# EAGLE design Sensor de Presença (EAGLE 8.2.2)
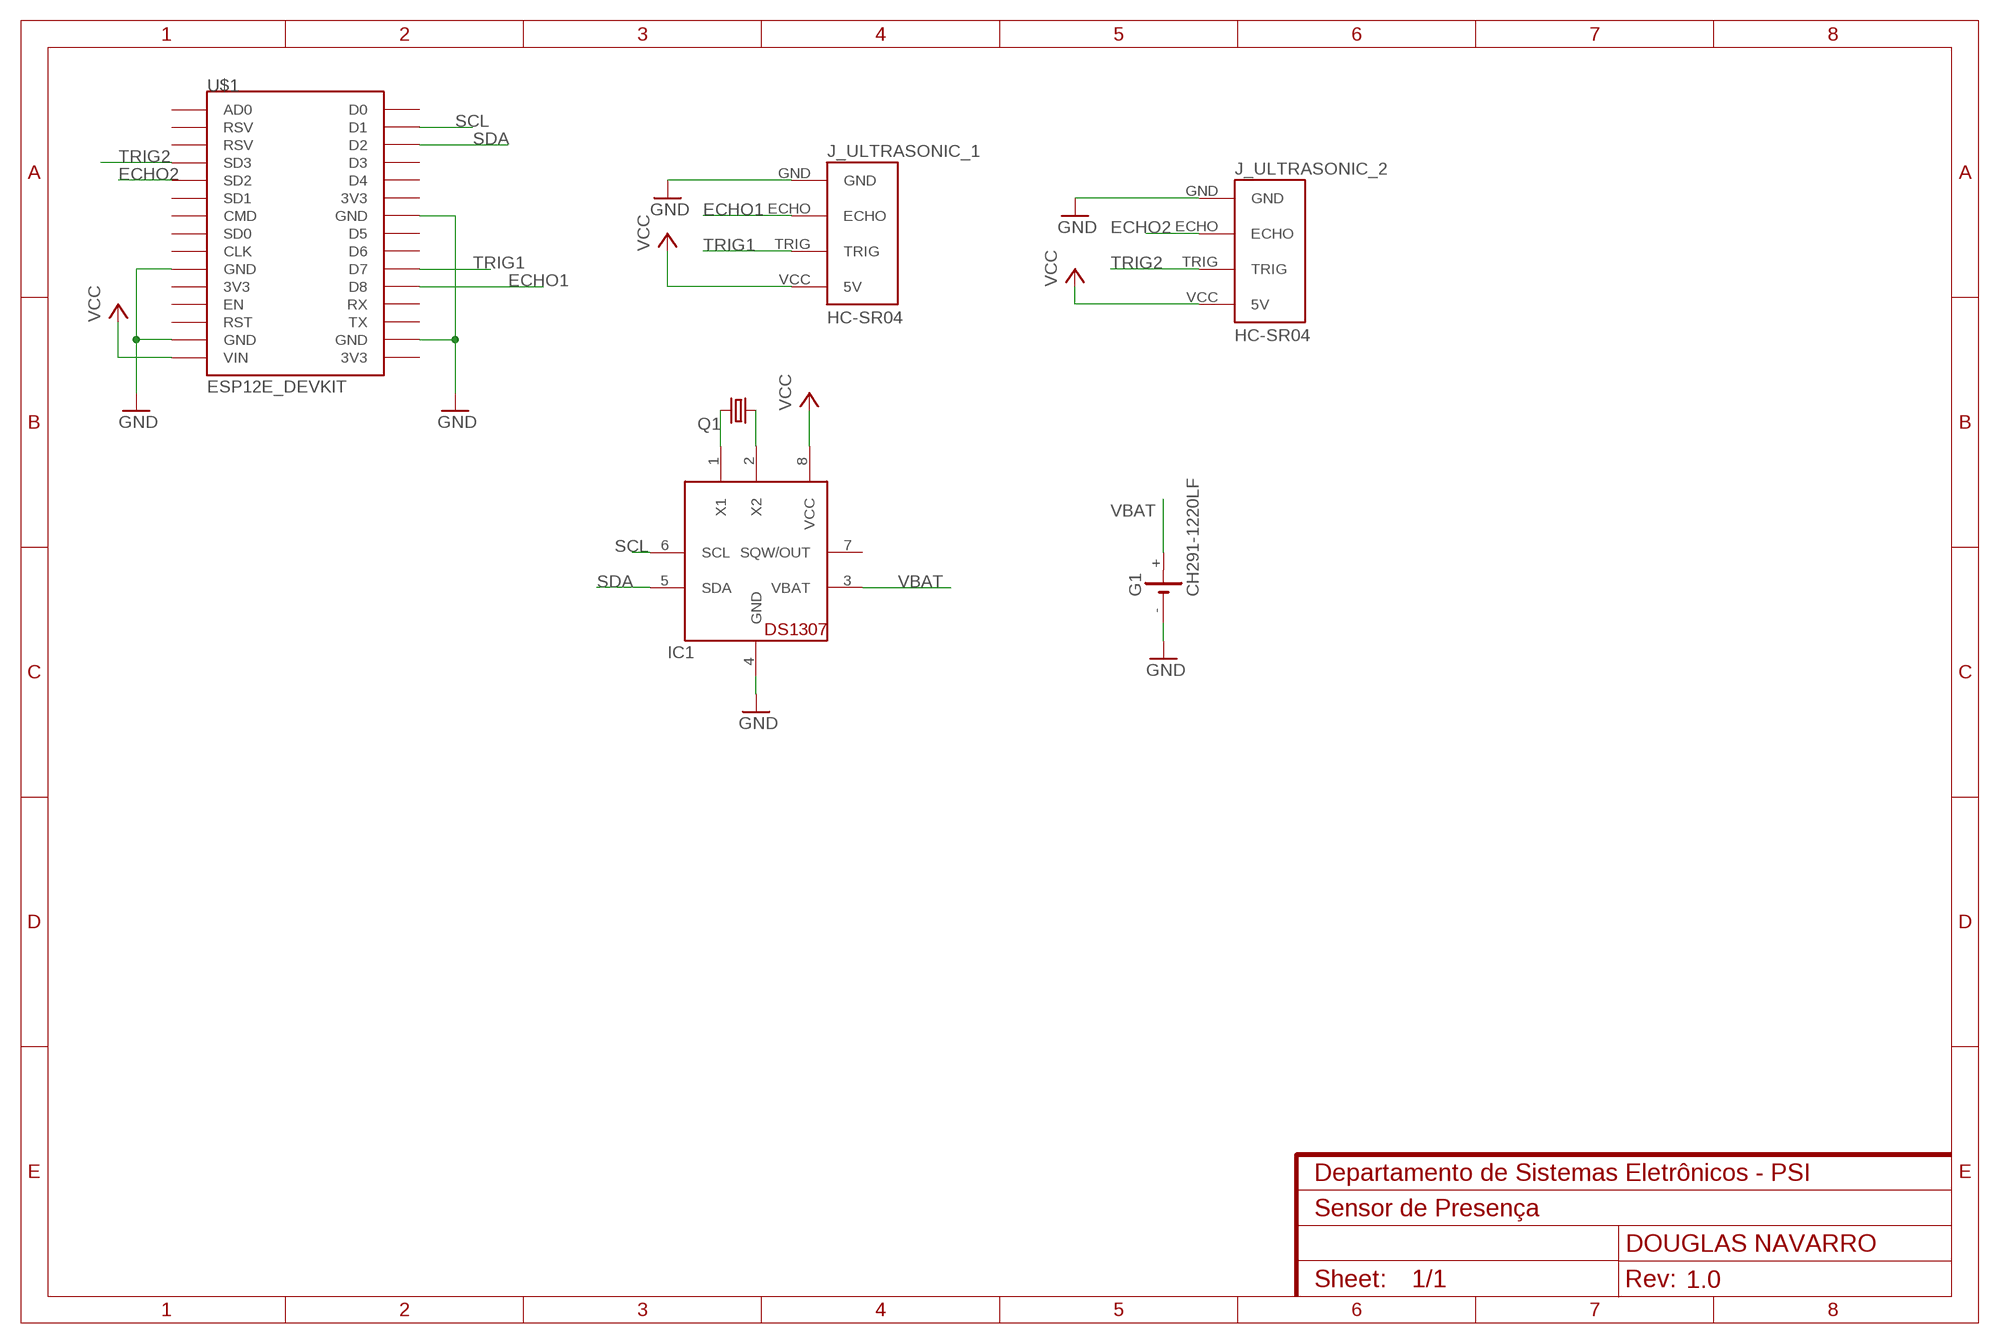
[diagram p0: schematic, sheet 1]

## Parts
G1  CH291-1220LF  [CH291-1220LF]
IC1  DS1307  [DIL08]
J_ULTRASONIC_1  HC-SR04  [HC-SR04_FOOTPRINT]
J_ULTRASONIC_2  HC-SR04  [HC-SR04_FOOTPRINT]
Q1  CRYSTALTC38H  [TC38H]
U$1  ESP12E_DEVKIT  [ESP12E_DEVKIT]

## Nets
ECHO1: J_ULTRASONIC_1.ECHO U$1.D8
ECHO2: J_ULTRASONIC_2.ECHO U$1.SD2
GND: G1.- IC1.4(GND) J_ULTRASONIC_1.GND J_ULTRASONIC_2.GND U$1.GND@0(GND) U$1.GND@1(GND) U$1.GND@2(GND) U$1.GND@3(GND)
N$1: IC1.1(X1) Q1.2
N$2: IC1.2(X2) Q1.1
SCL: IC1.6(SCL) U$1.D1
SDA: IC1.5(SDA) U$1.D2
TRIG1: J_ULTRASONIC_1.TRIG U$1.D7
TRIG2: J_ULTRASONIC_2.TRIG U$1.SD3
VBAT: G1.+ IC1.3(VBAT)
VCC: IC1.8(VCC) J_ULTRASONIC_1.VCC(5V) J_ULTRASONIC_2.VCC(5V) U$1.VIN
Unconnected: IC1.7(SQW/OUT) U$1.3V3@0(3V3) U$1.3V3@1(3V3) U$1.3V3@2(3V3) U$1.AD0 U$1.CLK U$1.CMD U$1.D0 U$1.D3 U$1.D4 U$1.D5 U$1.D6 U$1.EN U$1.RST U$1.RSV@0(RSV) U$1.RSV@1(RSV) U$1.RX U$1.SD0 U$1.SD1 U$1.TX

## Library data of the parts
G1 = battery:CH291-1220LF: Battery Holder, SMT, 12mm multicomp PART NO. CH291-1220LF Source: Data sheet <http://www.farnell.com/datasheets/1505860.pdf>
IC1 = adafruit:DS1307: DS1307 Real time clock (RTC) with battery backup ability. Talk to it via i2c
J_ULTRASONIC_1 J_ULTRASONIC_2 = Ultrasonic Sensor HC-SR04:HC-SR04: Ultrasonic Sensor HC-SR04
Q1 = adafruit:CRYSTAL: CRYSTAL; OC_FARNELL: unknown; OC_NEWARK: unknown
U$1 = ESP12E_DEVKIT:ESP12E_DEVKIT: ESP12E DEVKIT BOARD

## Board
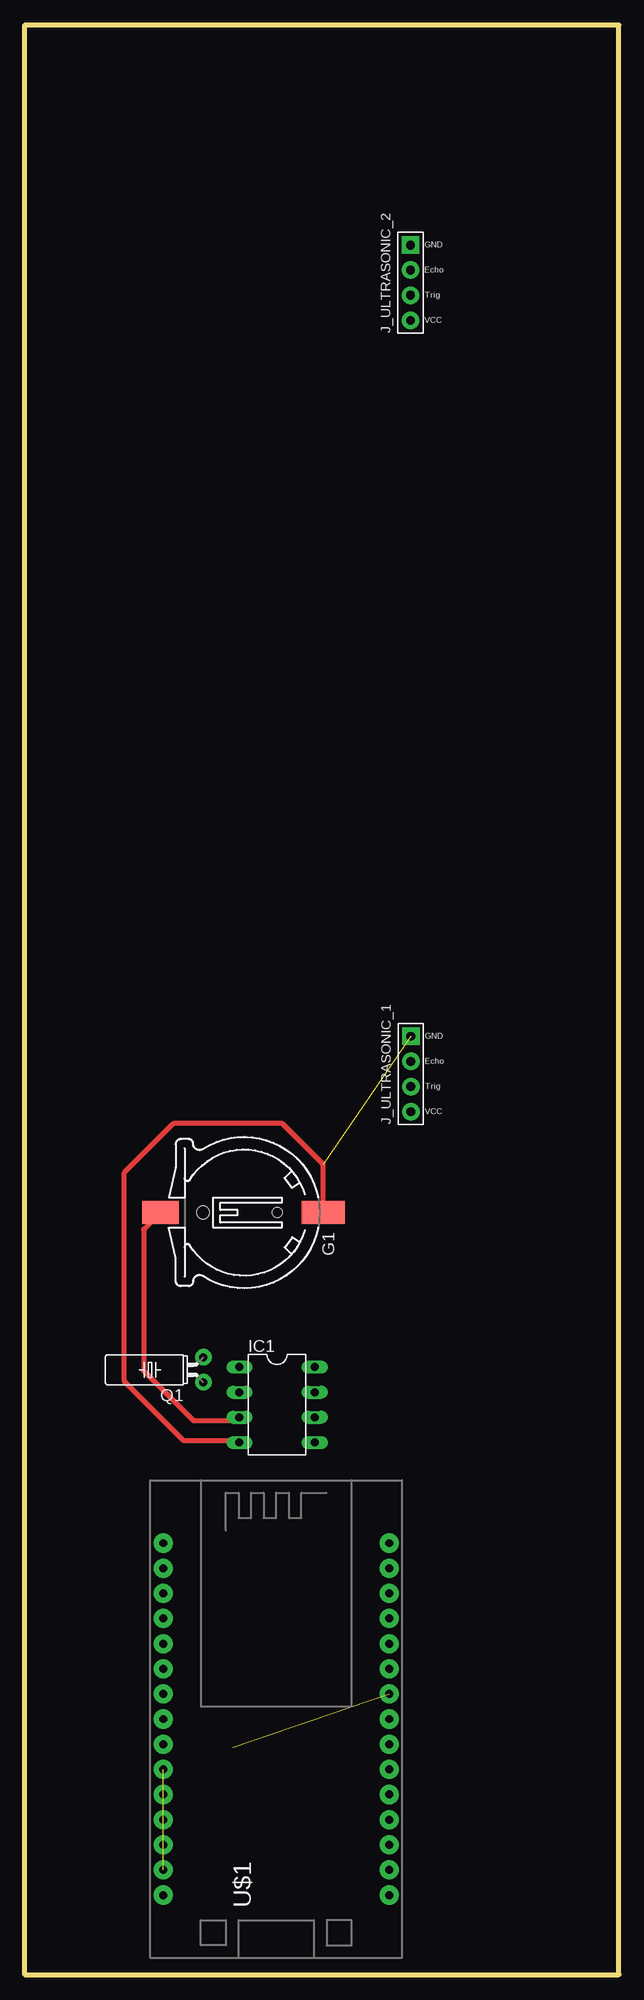
[diagram p1: board, top side]
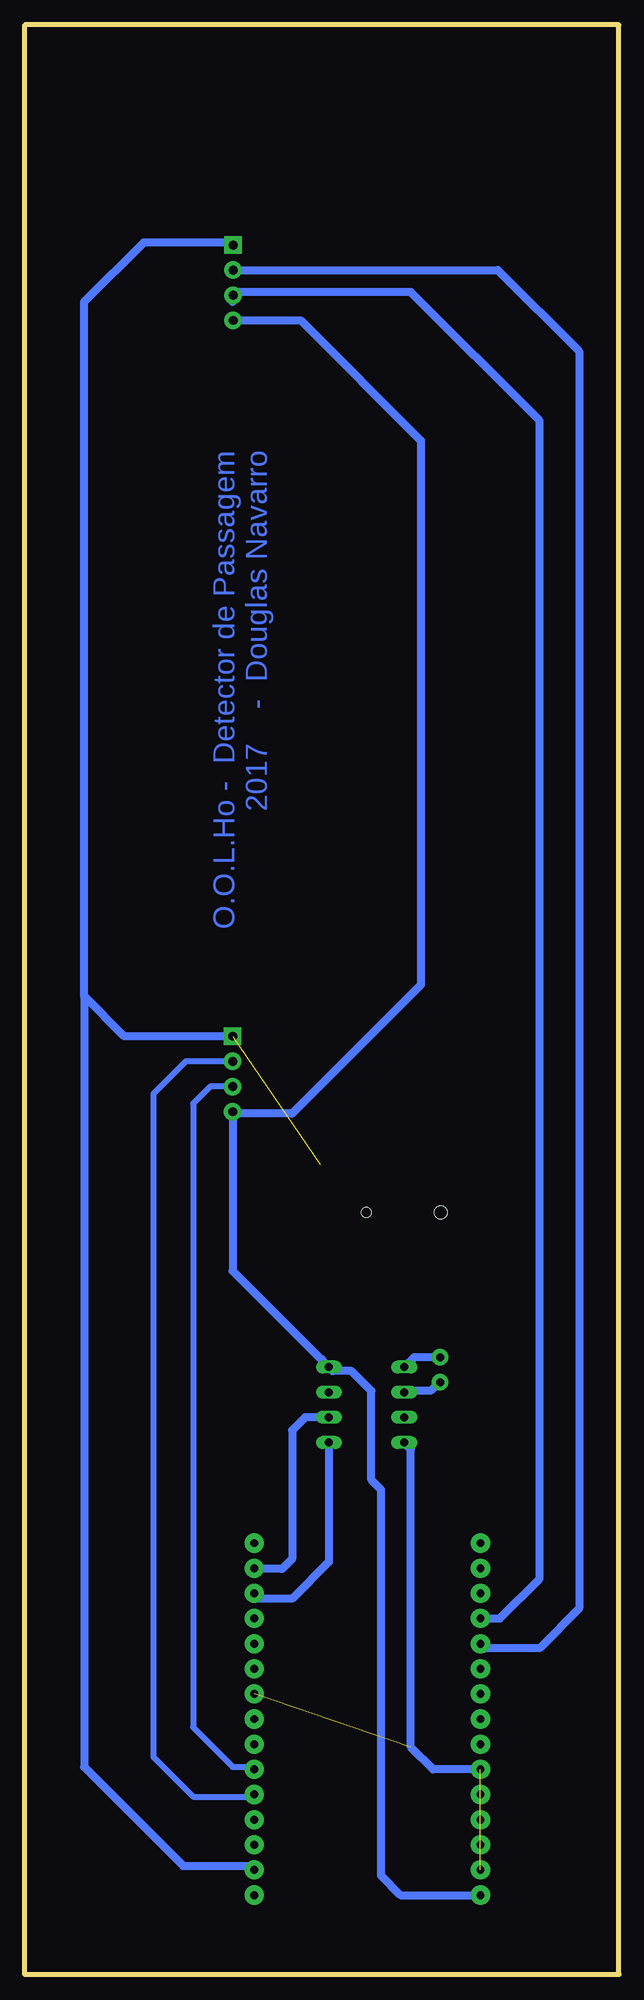
[diagram p2: board, bottom side, seen from below]

Size 60 x 197 mm. Coordinates in mm from the lower left corner, seen from the top.
Outline: 0,0 0,197 60,197 60,0 0,0
Copper layers (1*16): Top 0.035mm / dielectric 1.5mm / Bottom 0.035mm
Design rules "default *": minimum track width 6mil, minimum drill 0.35mm, track to track 1mil, track to pad 1mil, pad to pad 1mil, via to via 1mil, smd to smd 6mil, copper to edge 40mil, drill to drill 6mil, minimum pad ring 10mil, minimum via ring 8mil, stop-mask expansion 4mil, vias tented up to drill 0mil, thermal gap 10mil

### Footprints (pad centres in the part's own frame; a part is rotated, then mirrored left to right if it is on the bottom)
CH291-1220LF = smd 2.3 x 3.66: + 0,-2.296 | smd 2.3 x 4.3: - 0,14.146 | hole 1.3: 0,2 | hole 1: 0,9.5
DIL08 = drill 0.813 long: 1 -3.81,-3.81; 2 -1.27,-3.81; 3 1.27,-3.81; 4 3.81,-3.81; 5 3.81,3.81; 6 1.27,3.81; 7 -1.27,3.81; 8 -3.81,3.81
HC-SR04_FOOTPRINT = drill 0.9 pad 1.778: ECHO 0,1.27; TRIG 0,-1.27; VCC 0,-3.81 | drill 0.9 pad 1.778 square: GND 0,3.81
TC38H = drill 0.813 pad 1.676: 1 -1.27,0; 2 1.27,0
ESP12E_DEVKIT = drill 0.8 pad 1.93: 3V3@0 -11.43,-7.62; 3V3@1 11.43,5.08; 3V3@2 11.43,-17.78; AD0 -11.43,17.78; CLK -11.43,-2.54; CMD -11.43,2.54; D0 11.43,17.78; D1 11.43,15.24; D2 11.43,12.7; D3 11.43,10.16; D4 11.43,7.62; D5 11.43,0; D6 11.43,-2.54; D7 11.43,-5.08; D8 11.43,-7.62; EN -11.43,-10.16; GND@0 -11.43,-5.08; GND@1 -11.43,-15.24; GND@2 11.43,2.54; GND@3 11.43,-15.24; RST -11.43,-12.7; RSV@0 -11.43,15.24; RSV@1 -11.43,12.7; RX 11.43,-10.16; SD0 -11.43,0; SD1 -11.43,5.08; SD2 -11.43,7.62; SD3 -11.43,10.16; TX 11.43,-12.7; VIN -11.43,-17.78

### Placement (x,y rotation side)
G1  16,77 270 top
IC1  25.48,57.58 270 top
J_ULTRASONIC_1  39,91 0 top
J_ULTRASONIC_2  38.96,170.94 0 top
Q1  18.05,61.12 90 top
U$1  25.4,25.83 0 top

### Tracks (layer width: path | path; a pad name or v marks a point on that pad's centre or on a via)
ECHO1
  Bottom 0.61: J_ULTRASONIC_1.ECHO 43.73,92.27 47,89 47,22 43,18 37.04,18 U$1.D8
ECHO2
  Bottom 0.813: U$1.SD2 13.52,33 8,33 4,37 4,164 12.21,172.21 J_ULTRASONIC_2.ECHO
GND  (3 unrouted)
  Top 0.508: G1.- 30.15,81.85 26,86 15,86 10,81 10,60 16,54 21.44,54 IC1.4
  Bottom 0.813: U$1.GND@0 18.75,20.75 21,23 21,53.1 IC1.4 | J_ULTRASONIC_2.GND 39.21,175 48,175 54,169 54,98.87 | U$1.GND@3 37.24,11 44,11 54,21 54,98.87 | J_ULTRASONIC_1.GND 49.94,94.81 54,98.87
N$1
  Bottom 0.813: Q1.2 20.67,62.39 IC1.1
N$2
  Bottom 0.813: Q1.1 18.15,59.85 19,59 21.52,59 IC1.2
SCL
  Bottom 0.813: IC1.6 31.69,56.31 33,55 33,42 34,41 36.76,41 U$1.D1
SDA
  Bottom 0.813: IC1.5 29.29,41.71 33,38 36.3,38 U$1.D2
TRIG1
  Bottom 0.61: J_ULTRASONIC_1.TRIG 41.27,89.73 43,88 43,25 39,21 37.08,21 U$1.D7
TRIG2
  Bottom 0.813: 39,169 38.96,169.04 J_ULTRASONIC_2.TRIG 38.63,170 21,170 8,157 8,40 12.01,35.99 U$1.SD3
VBAT
  Top 0.508: G1.+ 12,75.3 12,61 17,56 21.36,56 IC1.3
VCC
  Bottom 0.813: IC1.8 28.9,61 27,61 25,59 25,50 24,49 24,10 22.05,8.05 U$1.VIN 13.92,8 | 30,62.19 30,62 29.39,61.39 IC1.8 | IC1.8 39,71.1 J_ULTRASONIC_1.VCC 38.81,87 33,87 20,100 20,155 32.13,167.13 J_ULTRASONIC_2.VCC

### Text on the board
Bottom: O.O.L.Ho - Detector de Passagem / 2017 - Douglas Navarro